# EAGLE design ospy_hw3.3_extensions (EAGLE 6.4)
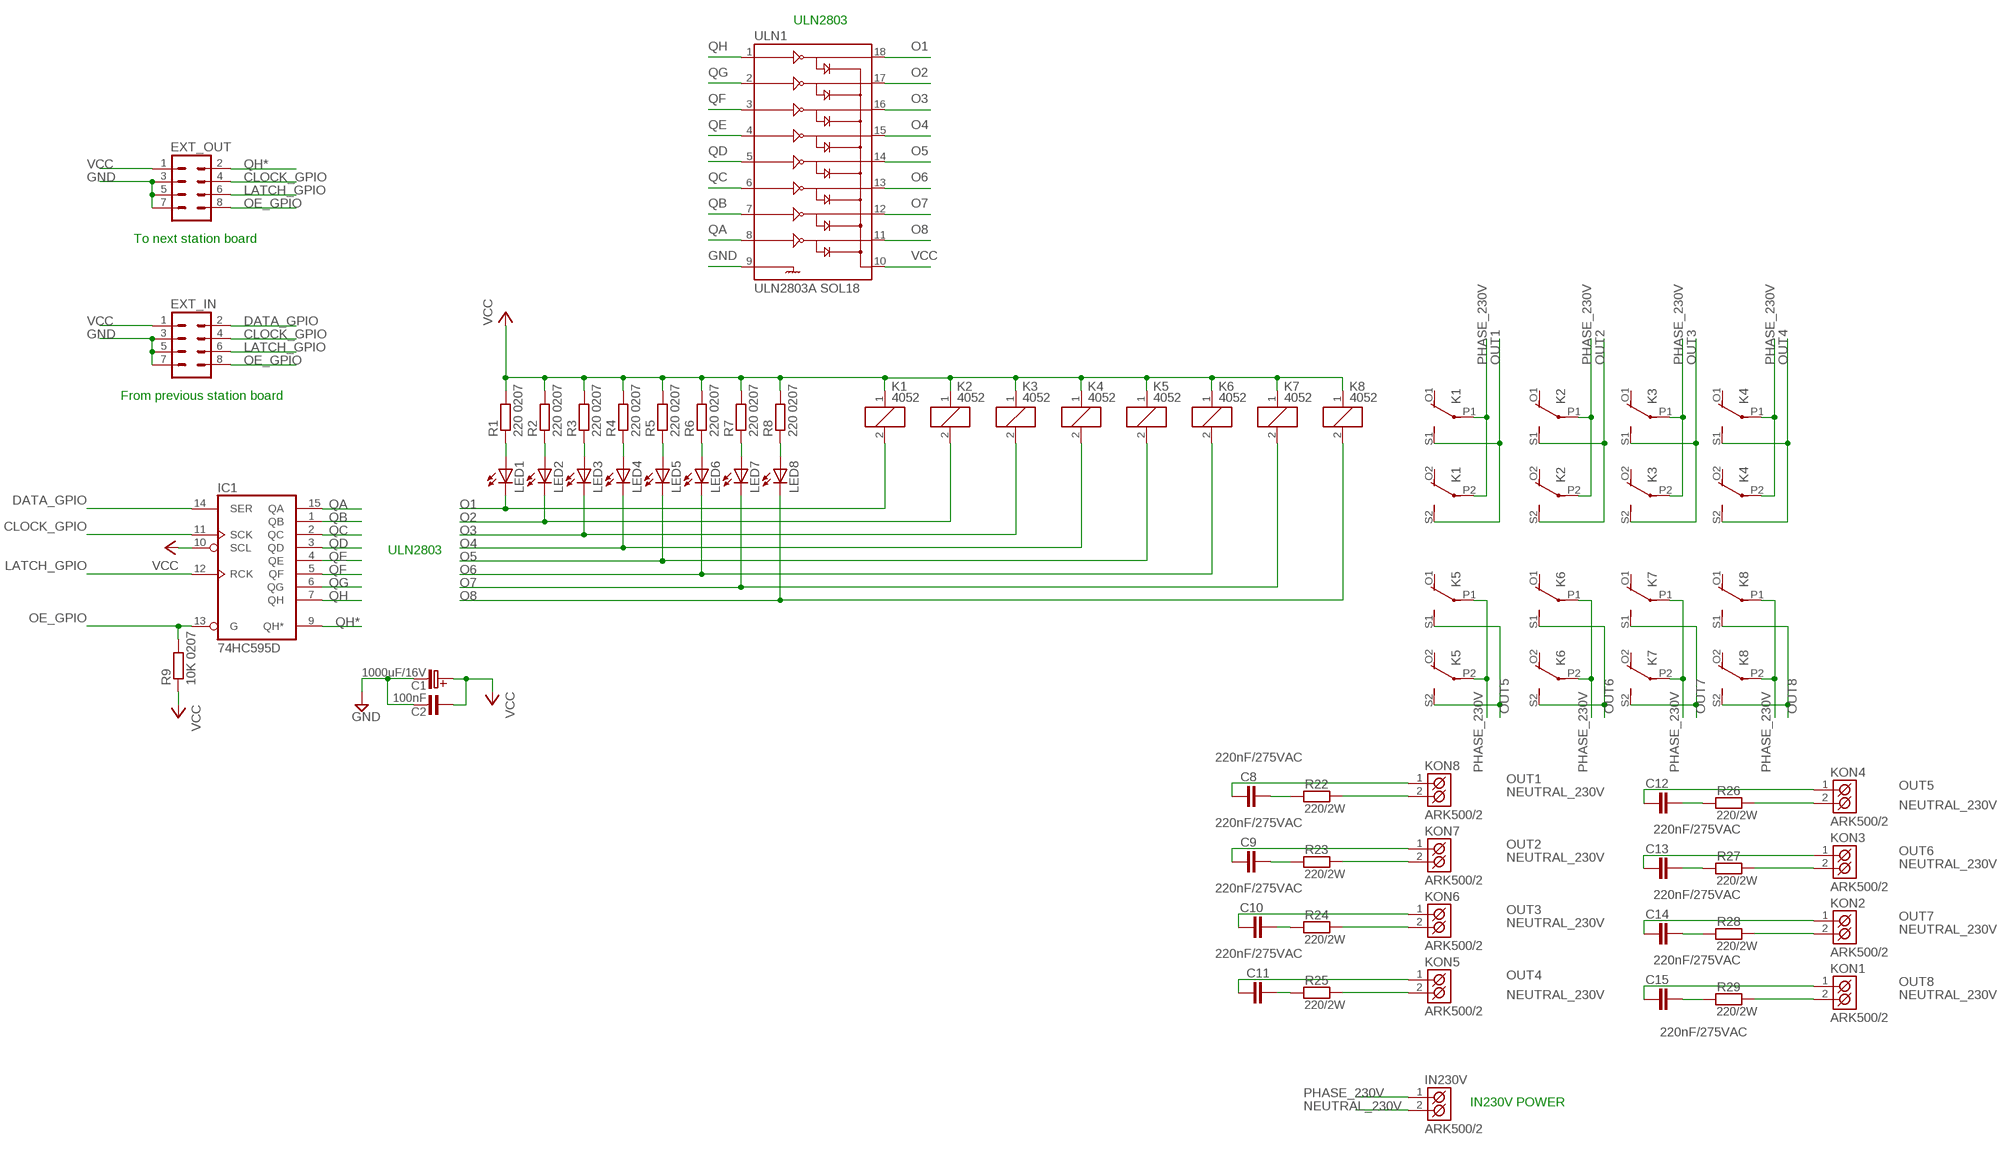
[diagram p0: schematic, sheet 1]

## Parts
C1  1000uF/16V  #_RADIAL_POUZDRA5  [C_EL_5]
C2  100nF  100N-J/63V  [RM5_2,5]
C8  220nF/275VAC  C-EU225-087X268  [C225-087X268]
C9  220nF/275VAC  C-EU225-087X268  [C225-087X268]
C10  220nF/275VAC  C-EU225-087X268  [C225-087X268]
C11  220nF/275VAC  C-EU225-087X268  [C225-087X268]
C12  220nF/275VAC  C-EU225-087X268  [C225-087X268]
C13  220nF/275VAC  C-EU225-087X268  [C225-087X268]
C14  220nF/275VAC  C-EU225-087X268  [C225-087X268]
C15  220nF/275VAC  C-EU225-087X268  [C225-087X268]
EXT_IN  M04X2  [2X4]
EXT_OUT  M04X2  [2X4]
IC1  74HC595D  [SO16]
IN230V  ARK500/2  [ARK500/2]
K1  4052  [F4052]
K2  4052  [F4052]
K3  4052  [F4052]
K4  4052  [F4052]
K5  4052  [F4052]
K6  4052  [F4052]
K7  4052  [F4052]
K8  4052  [F4052]
KON1  ARK500/2  [ARK500/2]
KON2  ARK500/2  [ARK500/2]
KON3  ARK500/2  [ARK500/2]
KON4  ARK500/2  [ARK500/2]
KON5  ARK500/2  [ARK500/2]
KON6  ARK500/2  [ARK500/2]
KON7  ARK500/2  [ARK500/2]
KON8  ARK500/2  [ARK500/2]
LED1  LED3MM  [LED3MM]
LED2  LED3MM  [LED3MM]
LED3  LED3MM  [LED3MM]
LED4  LED3MM  [LED3MM]
LED5  LED3MM  [LED3MM]
LED6  LED3MM  [LED3MM]
LED7  LED3MM  [LED3MM]
LED8  LED3MM  [LED3MM]
R1  220 0207  R-EU_0207/10  [0207/10]
R2  220 0207  R-EU_0207/10  [0207/10]
R3  220 0207  R-EU_0207/10  [0207/10]
R4  220 0207  R-EU_0207/10  [0207/10]
R5  220 0207  R-EU_0207/10  [0207/10]
R6  220 0207  R-EU_0207/10  [0207/10]
R7  220 0207  R-EU_0207/10  [0207/10]
R8  220 0207  R-EU_0207/10  [0207/10]
R9  10K 0207  R-EU_0207/10  [0207/10]
R22  220/2W  W2_220R  [R__2W]
R23  220/2W  W2_220R  [R__2W]
R24  220/2W  W2_220R  [R__2W]
R25  220/2W  W2_220R  [R__2W]
R26  220/2W  W2_220R  [R__2W]
R27  220/2W  W2_220R  [R__2W]
R28  220/2W  W2_220R  [R__2W]
R29  220/2W  W2_220R  [R__2W]
ULN1  ULN2803A SOL18  ULN2803SOICW  [SO18L]

## Nets
CLOCK_GPIO: EXT_IN.4 EXT_OUT.4 IC1.11(SCK)
DATA_GPIO: EXT_IN.2 IC1.14(SER)
GND: C1.C-(C_EL-) C2.2 EXT_IN.3 EXT_IN.5 EXT_IN.7 EXT_OUT.3 EXT_OUT.5 EXT_OUT.7 ULN1.9
LATCH_GPIO: EXT_IN.6 EXT_OUT.6 IC1.12(RCK)
N$17: LED1.A R1.1
N$18: LED2.A R2.1
N$19: LED3.A R3.1
N$20: LED4.A R4.1
N$21: LED5.A R5.1
N$22: LED6.A R6.1
N$23: LED7.A R7.1
N$24: LED8.A R8.1
N$36: C10.2 R24.1
N$37: C9.2 R23.1
N$39: C8.2 R22.1
N$40: C11.2 R25.1
N$41: C12.2 R26.1
N$43: C13.2 R27.1
N$44: C14.2 R28.1
N$45: C15.2 R29.1
NEUTRAL_230V: IN230V.2(K2) KON1.2(K2) KON2.2(K2) KON3.2(K2) KON4.2(K2) KON5.2(K2) KON6.2(K2) KON7.2(K2) KON8.2(K2) R22.2 R23.2 R24.2 R25.2 R26.2 R27.2 R28.2 R29.2
O1: K1.2 LED1.K(C) ULN1.18
O2: K2.2 LED2.K(C) ULN1.17
O3: K3.2 LED3.K(C) ULN1.16
O4: K4.2 LED4.K(C) ULN1.15
O5: K5.2 LED5.K(C) ULN1.14
O6: K6.2 LED6.K(C) ULN1.13
O7: K7.2 LED7.K(C) ULN1.12
O8: K8.2 LED8.K(C) ULN1.11
OE_GPIO: EXT_IN.8 EXT_OUT.8 IC1.13(G) R9.2
OUT1: C8.1 K1.S1(2:S) K1.S2(3:S) KON8.1(K1)
OUT2: C9.1 K2.S1(2:S) K2.S2(3:S) KON7.1(K1)
OUT3: C10.1 K3.S1(2:S) K3.S2(3:S) KON6.1(K1)
OUT4: C11.1 K4.S1(2:S) K4.S2(3:S) KON5.1(K1)
OUT5: C12.1 K5.S1(2:S) K5.S2(3:S) KON4.1(K1)
OUT6: C13.1 K6.S1(2:S) K6.S2(3:S) KON3.1(K1)
OUT7: C14.1 K7.S1(2:S) K7.S2(3:S) KON2.1(K1)
OUT8: C15.1 K8.S1(2:S) K8.S2(3:S) KON1.1(K1)
PHASE_230V: IN230V.1(K1) K1.P1(2:P) K1.P2(3:P) K2.P1(2:P) K2.P2(3:P) K3.P1(2:P) K3.P2(3:P) K4.P1(2:P) K4.P2(3:P) K5.P1(2:P) K5.P2(3:P) K6.P1(2:P) K6.P2(3:P) K7.P1(2:P) K7.P2(3:P) K8.P1(2:P) K8.P2(3:P)
QA: IC1.15(QA) ULN1.8
QB: IC1.1(QB) ULN1.7
QC: IC1.2(QC) ULN1.6
QD: IC1.3(QD) ULN1.5
QE: IC1.4(QE) ULN1.4
QF: IC1.5(QF) ULN1.3
QG: IC1.6(QG) ULN1.2
QH: IC1.7(QH) ULN1.1
QH*: EXT_OUT.2 IC1.9(QH*)
VCC: C1.C+(C_EL+) C2.1 EXT_IN.1 EXT_OUT.1 IC1.10(SCL) K1.1 K2.1 K3.1 K4.1 K5.1 K6.1 K7.1 K8.1 R1.2 R2.2 R3.2 R4.2 R5.2 R6.2 R7.2 R8.2 R9.1 ULN1.10
Unconnected: K1.O1(2:O) K1.O2(3:O) K2.O1(2:O) K2.O2(3:O) K3.O1(2:O) K3.O2(3:O) K4.O1(2:O) K4.O2(3:O) K5.O1(2:O) K5.O2(3:O) K6.O1(2:O) K6.O2(3:O) K7.O1(2:O) K7.O2(3:O) K8.O1(2:O) K8.O2(3:O)

## Notes on the sheet
- ULN2803
- To next station board
- From previous station board
- ULN2803
- IN230V POWER

## Power pins joined to a net without a drawn wire
GND: IC1.8(GND)
VCC: IC1.16(VCC)

## Library data of the parts
C1 = #PaJa_C-el_2:#_RADIAL_POUZDRA
C2 = #PaJa_C-folie:100N-J/63V
C8-C15 = rcl:C-EU: CAPACITOR, European symbol
EXT_IN EXT_OUT = SparkFun-Connectors:M04X2: .1" header, two rows of four.
IC1 = 74xx-eu:74*595: 8-bit SHIFT REGISTER, output latch
IN230V KON1-KON8 = #PaJa_konektory:ARK500/2: Svorkovnice - roztec 5mm - dvojita
K1-K8 = relay:4052: RELAY 2 x switch, Finder; OC_FARNELL: unknown; OC_NEWARK: unknown
LED1-LED8 = adafruit:LED: LED OSRAM: - CHIPLED LG R971, LG N971, LY N971, LG Q971, LY Q971, LO R971, LY R971 LH N974, LH R974 LS Q976, LO Q976, LY Q976 LO Q996 - Hyper CHIPLED LW Q18S LB Q993, LB Q99A, LB R99A - SideLED LS A670, LO A670, LY A670, LG A670, LP A670 LB A673, LV A673, LT A673, LW A673 LH A674 LY A675 LS A676, LA A676, LO A676, LY A676, LW A676 LS A679, LY A679, LG A679 - Hyper Micro SIDELED® LS Y876, LA Y876, LO Y876, LY Y876 LT Y87S - SmartLED LW L88C, LW L88S LB L89C, LB L89S, LG L890 LS L89K, LO L89K, LY L89K LS L896, LA L896, LO L896, LY L896 - TOPLED LS T670, LO T670, LY T670, LG T670, LP T670 LSG T670, LSP T670, LSY T670, LOP T670, LYG T670 LG T671, LOG T671, LSG T671 LB T673, LV T673, LT T673, LW T673 LH T674 LS T676, LA T676, LO T676, LY T676, LB T676, LH T676, LSB T676, LW T676 LB T67C, LV T67C, LT T67C, LS T67K, LO T67K, LY T67K, LW E67C LS E67B, LA E67B, LO E67B, LY E67B, LB E67C, LV E67C, LT E67C LW T67C LS T679, LY T679, LG T679 LS T770, LO T770, LY T770, LG T770, LP T770 LB T773, LV T773, LT T773, LW T773 LH T774 LS E675, LA E675, LY E675, LS T675 LS T776, LA T776, LO T776, LY T776, LB T776 LHGB T686 LT T68C, LB T68C - Hyper Mini TOPLED® LB M676 - Mini TOPLED Santana® LG M470 LS M47K, LO M47K, LY M47K Source: http://www.osram.convergy.de/
R1-R9 = rcl:R-EU_: RESISTOR, European symbol
R22-R29 = #PaJa_R:W2_220R
ULN1 = SparkFun-PowerIC:ULN2803: Darlington Driver ULN2803 Darlington array. 500mA max per channel, 8-channel package. Spark Fun Electronics SKU : COM-00312

## Board
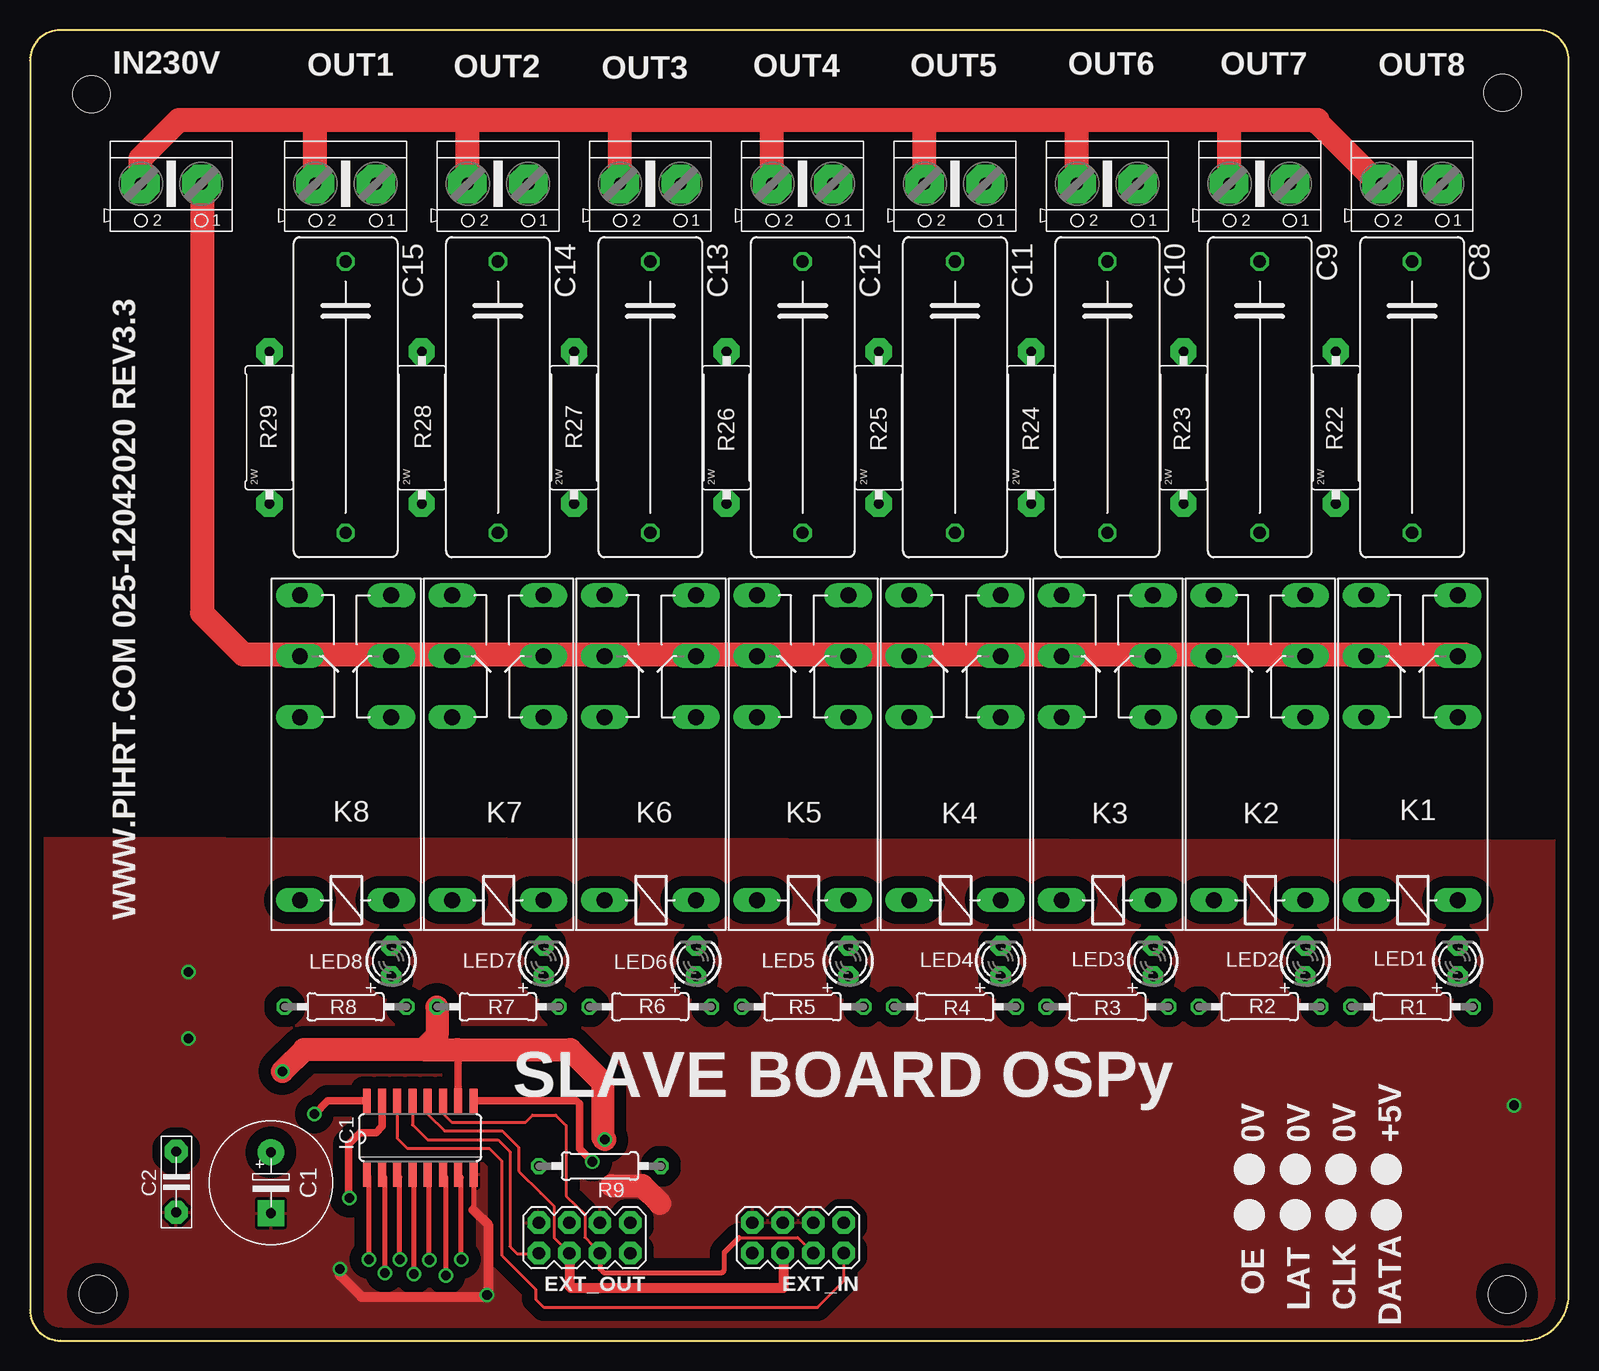
[diagram p1: board, top side]
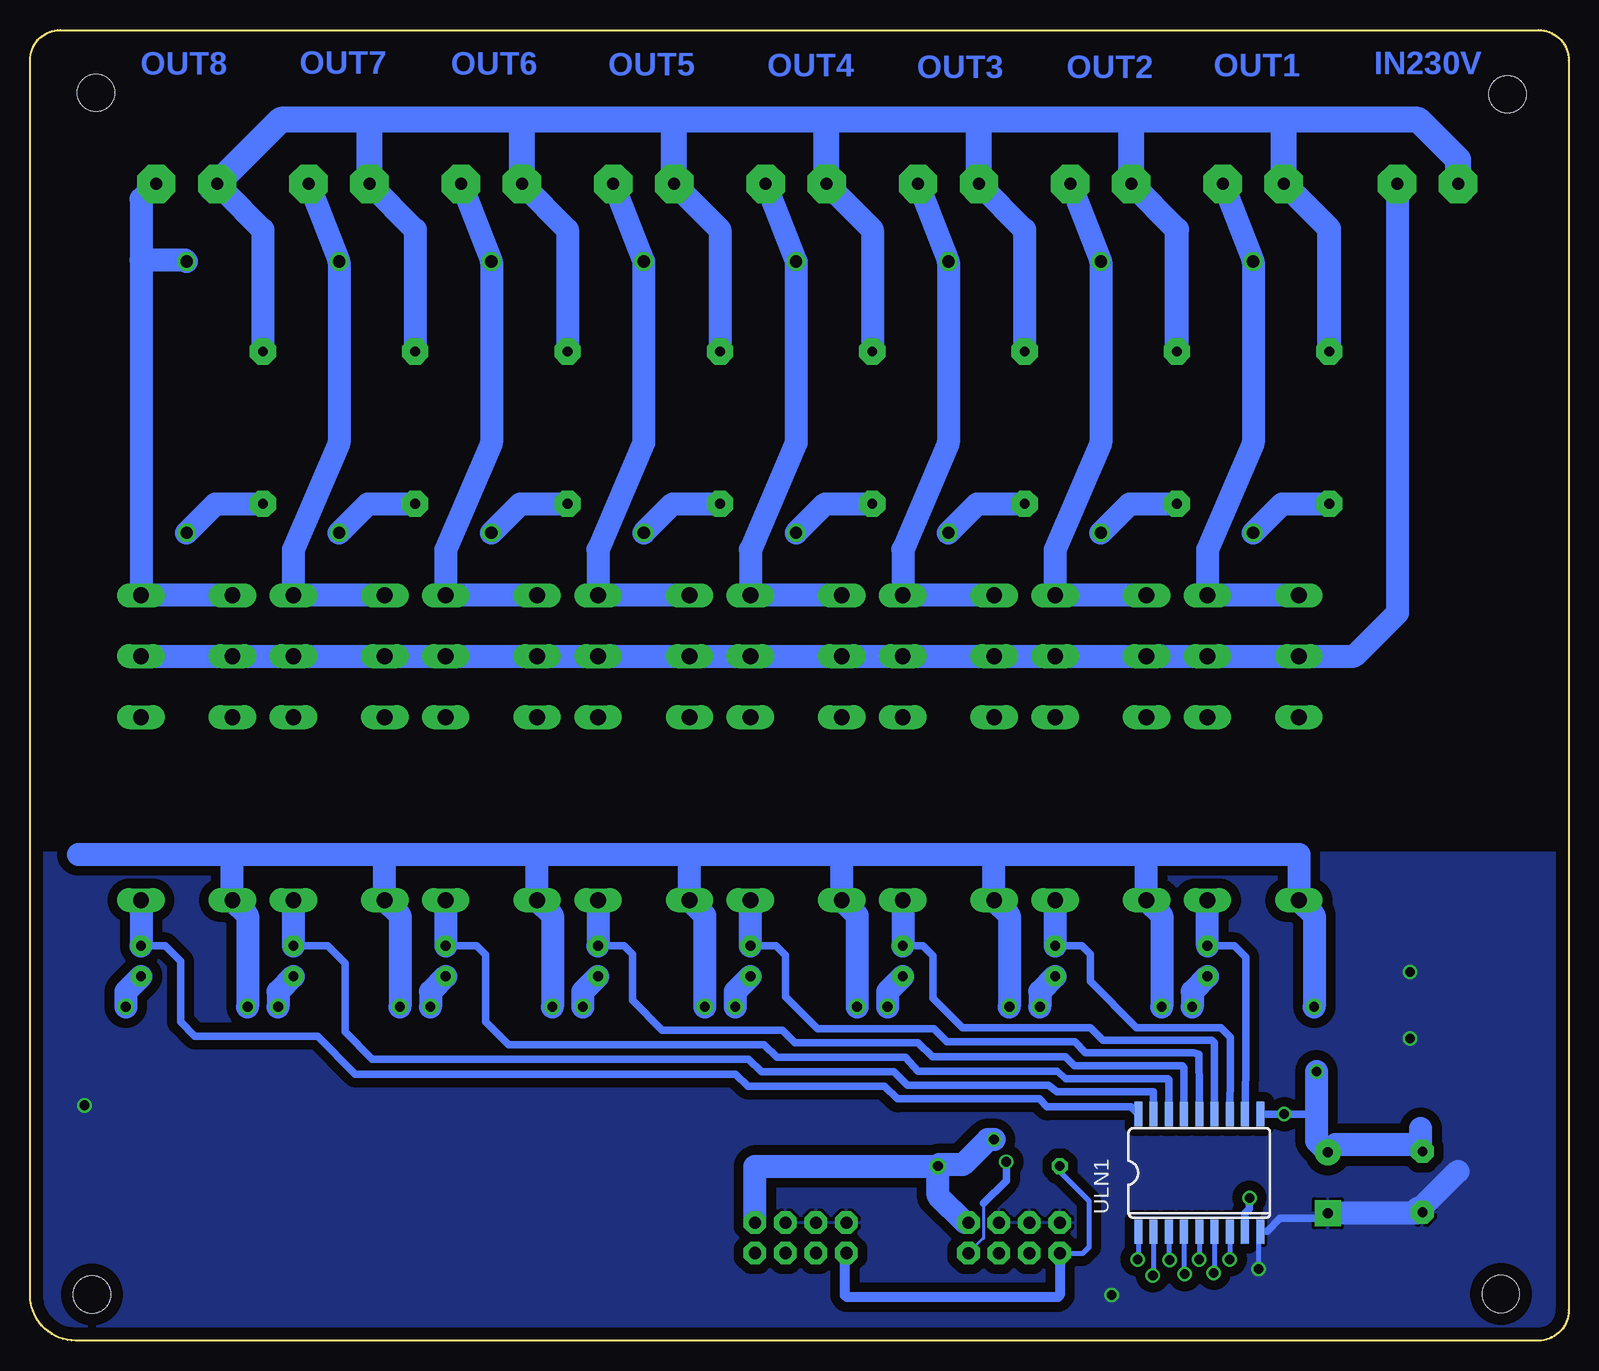
[diagram p2: board, bottom side, seen from below]

Size 128.27 x 109.22 mm. Coordinates in mm from the lower left corner, seen from the top.
Outline: 2.54,109.22 arc90 0,106.68 0,2.54 arc90 2.54,0 124.46,0 arc90 128.27,3.81 128.27,106.68 arc90 125.73,109.22 2.54,109.22
Copper layers (1*16): Top 0.035mm / dielectric 1.5mm / Bottom 0.035mm
Design rules "default": minimum track width 10mil, minimum drill 24mil, track to track 8mil, track to pad 8mil, pad to pad 8mil, via to via 8mil, smd to smd 8mil, copper to edge 40mil, drill to drill 8mil, minimum pad ring 10mil, minimum via ring 8mil, stop-mask expansion 4mil, vias tented up to drill 0mil, thermal gap 10mil
Holes 3.1 mm at 5.12,103.86 122.76,103.99 5.66,3.87 123.12,3.84

### Footprints (pad centres in the part's own frame; a part is rotated, then mirrored left to right if it is on the bottom)
C_EL_5 = drill 0.813 pad 2.184: C+ -2.54,0 | drill 0.813 pad 2.184 square: C- 2.54,0
RM5_2,5 = drill 0.813 pad 1.93 octagon: 1 -2.54,0; 2 2.54,0
C225-087X268 = drill 1.016 octagon: 1 -11.303,0; 2 11.303,0
2X4 = drill 1.016 pad 1.88 octagon: 1 -3.81,-1.27; 2 -3.81,1.27; 3 -1.27,-1.27; 4 -1.27,1.27; 5 1.27,-1.27; 6 1.27,1.27; 7 3.81,-1.27; 8 3.81,1.27
SO16 = smd 0.66 x 2.032: 1 -4.445,-3.073; 2 -3.175,-3.073; 3 -1.905,-3.073; 4 -0.635,-3.073; 5 0.635,-3.073; 6 1.905,-3.073; 7 3.175,-3.073; 8 4.445,-3.073; 9 4.445,3.073; 10 3.175,3.073; 11 1.905,3.073; 12 0.635,3.073; 13 -0.635,3.073; 14 -1.905,3.073; 15 -3.175,3.073; 16 -4.445,3.073
ARK500/2 = drill 1 pad 3.2 octagon: 1 -2.54,0; 2 2.54,0
F4052 = drill 1.321 long: 1 -3.81,3.81; 2 -3.81,-3.81; O1 11.43,-3.81; O2 11.43,3.81; P1 16.51,-3.81; P2 16.51,3.81; S1 21.59,-3.81; S2 21.59,3.81
LED3MM = drill 0.813 pad 1.676 octagon: A -1.27,0; K 1.27,0
0207/10 = drill 0.813 octagon: 1 -5.08,0; 2 5.08,0
R__2W = drill 0.813 pad 2.184 octagon: 1 -6.35,0; 2 6.35,0
SO18L = smd 0.66 x 2.032: 1 -0.635,-4.902; 2 0.635,-4.902; 3 1.905,-4.902; 4 3.175,-4.902; 5 4.445,-4.902; 6 5.715,-4.902; 7 6.985,-4.902; 8 8.255,-4.902; 9 9.525,-4.902; 10 9.525,4.902; 11 8.255,4.902; 12 6.985,4.902; 13 5.715,4.902; 14 4.445,4.902; 15 3.175,4.902; 16 1.905,4.902; 17 0.635,4.902; 18 -0.635,4.902

### Placement (x,y rotation side)
C1  20.09,13.16 270 top
C2  12.2,13.23 270 top
C8  115.21,78.62 270 top
C9  102.51,78.62 270 top
C10  89.81,78.62 270 top
C11  77.11,78.62 270 top
C12  64.41,78.62 270 top
C13  51.71,78.62 270 top
C14  39.01,78.62 270 top
C15  26.31,78.62 270 top
EXT_IN  64.03,8.57 180 top
EXT_OUT  46.23,8.56 180 top
IC1  32.53,16.92 0 top
IN230V  11.76,96.4 180 top
K1  115.21,40.52 90 top
K2  102.51,40.52 90 top
K3  89.81,40.52 90 top
K4  77.11,40.52 90 top
K5  64.41,40.52 90 top
K6  51.71,40.52 90 top
K7  39.01,40.52 90 top
K8  26.31,40.52 90 top
KON1  26.31,96.4 180 top
KON2  39.01,96.4 180 top
KON3  51.71,96.4 180 top
KON4  64.41,96.4 180 top
KON5  77.11,96.4 180 top
KON6  89.81,96.4 180 top
KON7  102.51,96.4 180 top
KON8  115.21,96.4 180 top
LED1  119.02,31.63 90 top
LED2  106.32,31.63 90 top
LED3  93.62,31.63 90 top
LED4  80.92,31.63 90 top
LED5  68.22,31.63 90 top
LED6  55.52,31.63 90 top
LED7  42.82,31.63 90 top
LED8  30.12,31.63 90 top
R1  115.21,27.82 180 top
R2  102.51,27.82 180 top
R3  89.81,27.82 180 top
R4  77.11,27.82 180 top
R5  64.41,27.82 180 top
R6  51.71,27.82 180 top
R7  39.01,27.82 180 top
R8  26.31,27.82 180 top
R9  47.51,14.55 180 top
R22  108.86,76.08 90 top
R23  96.16,76.08 90 top
R24  83.46,76.08 90 top
R25  70.76,76.08 90 top
R26  58.06,76.08 90 top
R27  45.36,76.08 90 top
R28  32.66,76.08 90 top
R29  19.96,76.08 90 top
ULN1  35.25,13.98 0 bottom

### Tracks (layer width: path | path; a pad name or v marks a point on that pad's centre or on a via)
CLOCK_GPIO
  Top 0.254: IC1.11 34.43,18.93 35.16,18.2 41.29,18.2 41.89,18.79 43.82,18.79 44.69,17.91 44.69,12.04 46.26,10.55 46.26,8.6 EXT_OUT.4 | 59.1,8.58 64.02,8.58 EXT_IN.4
  Top 0.406: EXT_OUT.4 47.5,5.98 47.81,5.67 57.7,5.67 57.89,5.87 57.89,7.37 59.1,8.58
DATA_GPIO
  Top 0.254: IC1.14 30.62,16.86 31.46,16.02 38.27,16.02 39.32,14.97 39.32,7.1 42.15,4.28 42.15,3.45 42.82,2.78 65.65,2.78 67.86,5 67.86,7.27 EXT_IN.2
GND  (via drill 0.8)
  Top 0.406: IC1.8 36.97,10.88 | 38.17,9.68 38.17,6.08
  Top 0.813: 36.97,10.88 38.17,9.68 38.17,3.64 27.64,3.64 25.84,5.44 v25.84,5.98
  Top 1.93: 48.5,12.92 51.03,12.92 52.5,11.45
  Bottom 0.406: v25.84,5.98 25.84,8.96 ULN1.9
  Bottom 0.61: 20.51,10.2 24.06,10.2 25.14,9.12 25.68,9.12 ULN1.9
  Bottom 0.813: C1.C- 20.51,10.2
  Bottom 1.93: 12.69,10.65 C2.2 12.59,11.01 | 12.69,10.65 12.98,10.62 C1.C- | 9.23,14.11 12.69,10.65
  other vias: 38.1,3.81 123.71,19.61 13.22,25.16 13.22,30.72
  pour Top (isolate 1.016): -7.14,41.9 133.49,41.64 133.81,-9.92 -6.83,-10.31 -7.14,41.9
  pour Bottom (isolate 0.813): -3.81,-6.47 134.53,-6.47 133.35,40.64 -3.81,40.64
LATCH_GPIO
  Top 0.254: IC1.12 33.16,18.86 34.55,17.47 39.37,17.47 40.74,16.1 40.74,14.13 42.6,12.28 | 42.6,12.28 | 42.6,12.28 43.71,11.18 43.71,8.56 EXT_OUT.6
  Top 0.813: EXT_OUT.6 44.96,4.52 45.08,4.4 62.77,4.4 62.85,4.48 62.85,7.2 EXT_IN.6
N$1
  Top 2: 14.34,96.2 14.34,60.63 17.78,57.2 119.63,57.2 119.74,57.09
N$17
  Bottom 1.93: LED1.A 120.29,29.09 R1.1
N$18
  Bottom 1.93: LED2.A 107.59,29.09 R2.1
N$19
  Bottom 1.93: LED3.A 94.89,29.09 R3.1
N$20
  Bottom 1.93: LED4.A 82.19,29.09 R4.1
N$21
  Bottom 1.93: LED5.A 69.49,29.09 R5.1
N$22
  Bottom 1.93: LED6.A 56.79,29.09 R6.1
N$23
  Bottom 1.93: LED7.A 44.09,29.09 R7.1
N$24
  Bottom 1.93: LED8.A 31.39,29.09 R8.1
N$36
  Bottom 1.93: C10.2 87.4,69.73 R24.1
N$37
  Bottom 1.93: C9.2 100.09,69.73 R23.1
N$39
  Bottom 1.93: C8.2 112.79,69.73 R22.1
N$40
  Bottom 1.93: C11.2 74.69,69.73 R25.1
N$41
  Bottom 1.93: C12.2 61.99,69.73 R26.1
N$43
  Bottom 1.93: C13.2 49.29,69.73 R27.1
N$44
  Bottom 1.93: C14.2 36.59,69.73 R28.1
N$45
  Bottom 1.93: C15.2 23.9,69.73 R29.1
NEUTRAL_230V
  Top 2: KON2.2 36.47,101.71 36.48,101.72 37.56,101.72 | 37.56,101.72 49.09,101.72 | 49.09,101.72 61.92,101.72 | 61.92,101.72 74.68,101.72 | 74.68,101.72 87.52,101.72 | 87.52,101.72 99.9,101.72 | 99.9,101.72 107.35,101.72 107.35,101.49 112.44,96.4 KON8.2 | KON7.2 99.97,101.65 99.9,101.72 | KON6.2 87.27,101.47 87.52,101.72 | KON5.2 74.57,101.61 74.68,101.72 | KON4.2 61.87,101.67 61.92,101.72 | KON3.2 49.17,101.64 49.09,101.72 | IN230V.2 9.22,98.52 12.42,101.72 23.72,101.72 | 23.72,101.72 37.56,101.72 | KON1.2 23.77,101.67 23.72,101.72
  Bottom 1.93: KON7.2 96.16,92.59 R23.2 | KON8.2 112.12,95.86 108.86,92.59 R22.2 | KON6.2 83.46,92.59 R24.2 | KON5.2 70.76,92.59 R25.2 | KON4.2 58.06,92.59 R26.2 | KON3.2 45.36,92.59 R27.2
  Bottom 2: R29.2 19.96,92.65 23.71,96.4 KON1.2 | R28.2 32.66,92.59 KON2.2
  Bottom 2.184: IN230V.2 9.22,98.41 12.54,101.74 24.09,101.74 | 24.09,101.74 36.44,101.74 | 36.44,101.74 48.92,101.74 | 48.92,101.74 61.77,101.74 | 61.77,101.74 74.55,101.74 | 74.55,101.74 87.32,101.74 | 87.32,101.74 100.17,101.74 | 100.17,101.74 107.36,101.74 113.11,96 112.26,96 112.12,95.86 | KON7.2 99.97,101.53 100.17,101.74 | KON6.2 87.27,101.69 87.32,101.74 | KON5.2 74.57,101.72 74.55,101.74 | KON4.2 61.87,101.65 61.77,101.74 | KON3.2 49.17,101.49 48.92,101.74 | KON2.2 36.47,101.72 36.44,101.74 | KON1.2 23.77,101.42 24.09,101.74
O1
  Bottom 0.61: ULN1.18 36.49,19.48 43.48,19.48 44.14,20.14 55.96,20.14 57.03,21.21 68.43,21.21 69.44,22.22 101.16,22.22 104.31,25.37 114.52,25.37 115.71,26.56 115.71,31.61 117,32.9 LED1.K
  Bottom 1.93: K1.2 LED1.K
O2
  Bottom 0.61: ULN1.17 34.63,18.9 34.63,20.73 42.68,20.73 43.38,21.27 55.13,21.27 56.26,22.4 67.3,22.4 68.37,23.47 99.73,23.47 101.99,25.72 101.99,31.43 103.46,32.9 LED2.K
  Bottom 1.93: K2.2 LED2.K
O3
  Bottom 0.61: ULN1.16 33.35,19.44 33.35,21.74 33.42,21.81 41.9,21.81 42.68,22.45 54.26,22.45 55.31,23.6 66,23.6 67.07,24.67 88.38,24.67 90.3,26.59 90.3,32.16 91.05,32.9 LED3.K
  Bottom 1.93: K3.2 LED3.K
O4
  Bottom 0.61: ULN1.15 32.07,20.63 32.07,22.76 32.22,22.91 41.23,22.91 41.97,23.65 53.06,23.65 54.24,24.84 64.49,24.84 65.53,25.88 75.58,25.88 78.05,28.35 78.05,32.22 78.74,32.9 LED4.K
  Bottom 1.93: K4.2 LED4.K
O5
  Bottom 0.61: ULN1.14 30.79,20.65 30.82,23.88 31.28,24 40.29,24 41.18,24.89 51.82,24.89 52.91,25.98 62.61,25.98 65.28,28.65 65.28,32.12 66.07,32.9 LED5.K
  Bottom 1.93: LED5.K K5.2
O6
  Bottom 0.61: ULN1.13 29.55,22.63 29.55,24.84 29.74,25.04 38.85,25.04 39.89,26.08 50.53,26.08 53.01,28.55 53.01,32.07 53.84,32.9 LED6.K
  Bottom 1.93: K6.2 LED6.K
O7
  Bottom 0.61: ULN1.12 28.21,22.57 28.21,25.28 29,26.08 36.03,26.08 39.89,29.94 39.89,32.22 40.58,32.9 LED7.K
  Bottom 1.93: K7.2 LED7.K
O8
  Bottom 0.61: ULN1.11 26.92,22.59 26.92,31.97 27.86,32.9 LED8.K
  Bottom 1.93: LED8.K K8.2
OE_GPIO
  Top 0.254: IC1.13 31.89,17.99 33.16,16.72 39.01,16.72 40.01,15.73 40.01,7.83 40.59,7.25 42.38,7.25 EXT_OUT.8
  Bottom 0.406: R9.2 42.43,14.08 39.99,11.64 39.99,7.78 40.52,7.25 42.38,7.25 EXT_OUT.8
  Bottom 0.813: EXT_OUT.8 42.42,3.79 42.58,3.64 60.21,3.64 60.34,3.77 60.34,7.17 EXT_IN.8
OUT1
  Bottom 1.93: K1.S2 K1.S1 119.02,90.05 | KON8.1 119.02,95.13 119.02,90.05 | C8.1 115.34,90.05 119.02,90.05
OUT2
  Bottom 1.93: K2.S2 K2.S1 106.32,65.92 102.51,74.81 C9.1 KON7.1
OUT3
  Bottom 1.93: K3.S2 K3.S1 93.62,65.92 89.81,74.81 C10.1 KON6.1
OUT4
  Bottom 1.93: K4.S2 K4.S1 80.92,65.92 77.11,74.81 C11.1 KON5.1
OUT5
  Bottom 1.93: K5.S2 K5.S1 68.22,65.92 64.41,74.81 C12.1 KON4.1
OUT6
  Bottom 1.93: K6.S2 K6.S1 55.52,65.92 51.71,74.81 C13.1 KON3.1
OUT7
  Bottom 1.93: K7.S2 K7.S1 42.82,65.92 39.01,74.81 C14.1 KON2.1
OUT8
  Bottom 1.93: K8.S2 K8.S1 30.12,65.92 26.31,74.81 C15.1 KON1.1
PHASE_230V
  Bottom 1.93: K1.P1 K1.P2 K2.P1 K2.P2 K3.P1 K3.P2 K4.P1 | 79.65,57.03 K4.P1 | K4.P1 K4.P2 K5.P1 K5.P2 K6.P1 K6.P2 K7.P1 K7.P2 | 33.93,57.03 K7.P2 | K7.P2 K8.P1 K8.P2 17.88,57.03 14.27,60.64 14.27,96.37 IN230V.1
QA  (via drill 0.8)
  Top 0.61: IC1.15 29.35,17.85 28.84,17.34 27.54,17.34 26.58,16.38 26.58,11.93 v26.62,11.89
  Bottom 0.61: v26.62,11.89 26.62,11 26.99,10.63 ULN1.8
QB  (via drill 0.8)
  Top 0.406: v28.26,6.77 28.26,13.67 IC1.1
  Bottom 0.406: ULN1.7 v28.26,6.78 v28.26,6.77
QC  (via drill 0.8)
  Top 0.406: v29.59,5.64 29.59,13.61 IC1.2
  Bottom 0.406: ULN1.6 29.53,5.7 v29.59,5.64
  Bottom 0.61: ULN1.6 29.55,9.06
QD  (via drill 0.8)
  Top 0.406: v30.82,6.77 30.82,13.64 IC1.3
  Bottom 0.406: ULN1.5 30.8,6.79 v30.82,6.77
QE  (via drill 0.8)
  Top 0.406: v32,5.54 32,13.73 IC1.4
  Bottom 0.406: ULN1.4 32.07,5.61 v32,5.54
  Bottom 0.61: ULN1.4 32.09,9.06
QF  (via drill 0.8)
  Top 0.406: v33.29,6.72 33.29,13.72 IC1.5
  Bottom 0.406: ULN1.3 33.34,6.78 v33.29,6.72
  Bottom 0.61: ULN1.3 33.36,9.06
QG  (via drill 0.8)
  Top 0.406: v34.67,5.44 34.67,13.61 IC1.6
  Bottom 0.406: ULN1.2 34.61,5.5 v34.67,5.44
  Bottom 0.61: ULN1.2 34.63,9.06
QH  (via drill 0.8)
  Top 0.406: v35.95,6.77 35.95,13.6 IC1.7
  Bottom 0.406: ULN1.1 35.88,6.84 v35.95,6.77
  Bottom 0.61: ULN1.1 35.9,9.06
QH*  (via drill 0.8)
  Top 0.61: IC1.9 45.54,19.99 45.79,19.74 45.79,16 v46.89,14.91
  Bottom 0.254: 48.78,11.45 48.78,8.52 48.82,8.52 EXT_OUT.2
  Bottom 0.61: v46.89,14.91 46.89,13.33 48.78,11.45
VCC  (via drill 0.8)
  Top 0.61: 35.64,24.26 35.7,24.2 IC1.10 | 28.08,24.22 28.04,24.26 | IC1.16 24.82,19.99 v23.71,18.88
  Top 1.93: R7.2 33.93,25.4 32.78,24.26 | 32.78,24.26 28.04,24.26 22.85,24.26 v21.03,22.44 | 32.78,24.26 35.64,24.26 45.04,24.26 47.74,21.55 47.74,16.93 v47.91,16.76
  Bottom 0.61: ULN1.10 v23.71,18.88 21.14,18.88 21.03,18.98
  Bottom 0.813: 52.79,14.34 R9.1 52.58,14.53 | EXT_OUT.1 50.11,9.83
  Bottom 1.93: R8.2 21.23,35.44 K8.1 22.5,40.52 35.2,40.52 | 35.2,40.52 K7.1 33.93,35.44 R7.2 | 47.9,40.52 K6.1 46.63,35.44 R6.2 | 47.9,40.52 35.2,40.52 | 60.6,40.52 K5.1 59.33,35.44 R5.2 | 60.6,40.52 47.9,40.52 | 73.3,40.52 K4.1 72.03,35.44 R4.2 | 73.3,40.52 60.6,40.52 | 86,40.52 K3.1 84.73,35.44 R3.2 | 86,40.52 73.3,40.52 | 98.7,40.52 K2.1 97.43,35.44 R2.2 | 98.7,40.52 86,40.52 | 111.4,40.52 K1.1 110.13,35.44 R1.2 | 111.4,40.52 98.7,40.52 | C2.1 12.34,16.34 | 12.34,16.34 12.34,17.66 | 124.24,40.52 111.4,40.52 | 12.34,16.34 19.45,16.34 C1.C+ 21.03,16.65 21.03,18.98 v21.03,22.44 | v47.91,16.76 48.43,16.76 50.52,14.67 52.47,14.67 R9.1 | 50.11,9.83 50.31,9.83 52.57,12.09 52.57,14.53 R9.1 | EXT_IN.1 67.84,14.5 67.81,14.53 52.61,14.53 R9.1

### Text on the board
Bottom: IN230V | OUT1 | OUT2 | OUT3 | OUT4 | OUT5 | OUT6 | OUT7 | OUT8
tNames: IN230V | OUT1 | OUT2 | OUT3 | OUT4 | OUT5 | OUT6 | OUT7 | OUT8 | WWW.PIHRT.COM 025-12042020 REV3.3 | SLAVE BOARD OSPy | 0V | 0V | 0V | +5V | OE | LAT | CLK | DATA